# EasyEDA Pro project zkxh_robot_race_FOC_2025.eprj, schematic Schematic1
Board Name: stm32g431_foc; Create Date: 2025-09-25; Page Name: P1; Project Name: zkxh_robot_race_FOC_2025; Schematic Name: Schematic1; Update Date: 2025-09-27; Company: 嘉立创EDA; Page Size: A4; Version: V1.0
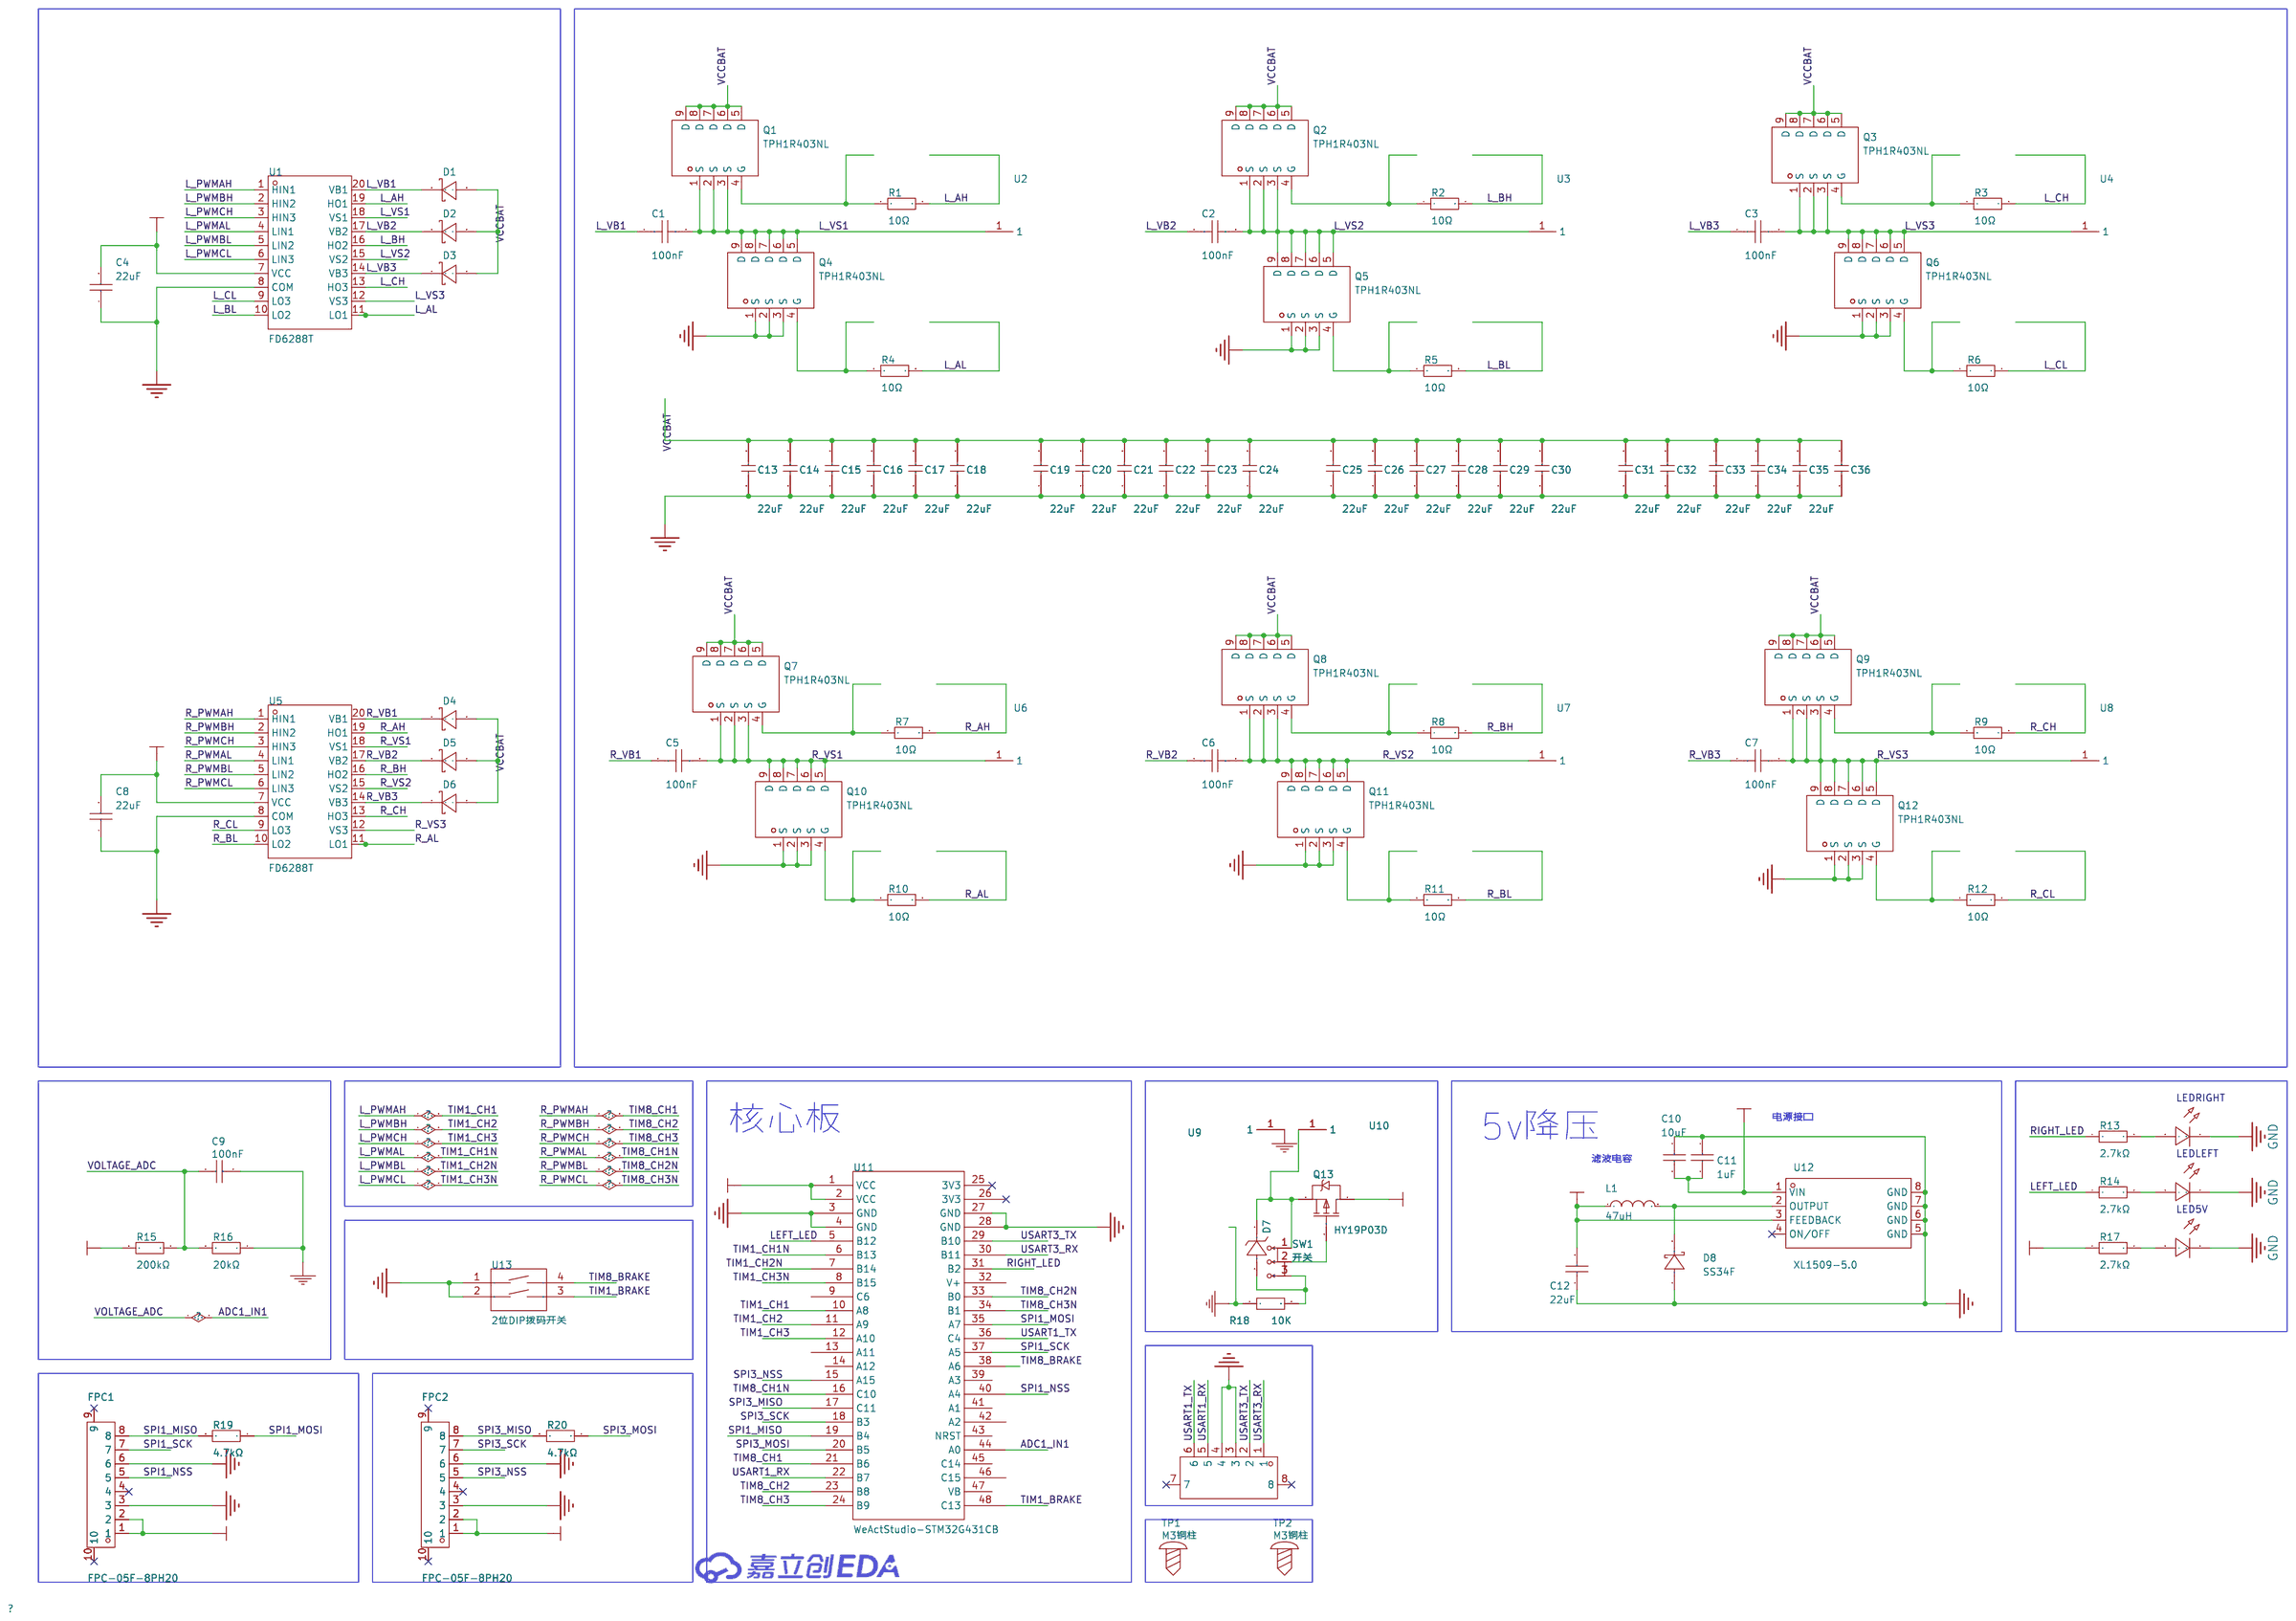
[diagram p0: schematic sheet]

## Parts
C1  100nF  [C0603]
C2  100nF  [C0603]
C3  100nF  [C0603]
C4  22uF  [C0603]
C5  100nF  [C0603]
C6  100nF  [C0603]
C7  100nF  [C0603]
C8  22uF  [C0603]
C9  100nF  [C0603]
C10  10uF  [C1206]
C11  1uF  [C0603]
C12  22uF  [C0603]
C13  22uF  [C1206]
C14  22uF  [C1206]
C15  22uF  [C1206]
C16  22uF  [C1206]
C17  22uF  [C1206]
C18  22uF  [C1206]
C19  22uF  [C1206]
C20  22uF  [C1206]
C21  22uF  [C1206]
C22  22uF  [C1206]
C23  22uF  [C1206]
C24  22uF  [C1206]
C25  22uF  [C1206]
C26  22uF  [C1206]
C27  22uF  [C1206]
C28  22uF  [C1206]
C29  22uF  [C1206]
C30  22uF  [C1206]
C31  22uF  [C1206]
C32  22uF  [C1206]
C33  22uF  [C1206]
C34  22uF  [C1206]
C35  22uF  [C1206]
C36  22uF  [C1206]
D1  1N5819WS  [SOD-323_L1.8-W1.3-LS2.5-RD]
D2  1N5819WS  [SOD-323_L1.8-W1.3-LS2.5-RD]
D3  1N5819WS  [SOD-323_L1.8-W1.3-LS2.5-RD]
D4  1N5819WS  [SOD-323_L1.8-W1.3-LS2.5-RD]
D5  1N5819WS  [SOD-323_L1.8-W1.3-LS2.5-RD]
D6  1N5819WS  [SOD-323_L1.8-W1.3-LS2.5-RD]
D7  BZT52C16  [SOD-123_L2.7-W1.7-LS3.8-RD]
D8  SS34F  [SMAF_L3.5-W2.6-LS4.7-FD]
FPC1  FPC-05F-8PH20  [FPC-SMD_8P-P0.50_FPC-05F-8PH20]
FPC2  FPC-05F-8PH20  [FPC-SMD_8P-P0.50_FPC-05F-8PH20]
L1  47uH  [IND-SMD_L7.0-W6.6_FXL0630]
LED5V  -  [LED_0805]
LEDLEFT  -  [LED_0805]
LEDRIGHT  -  [LED_0805]
Q1  TPH1R403NL  [DSOP-8_L5.0-W5.0-P1.27-LS6.0-BL-EP]
Q2  TPH1R403NL  [DSOP-8_L5.0-W5.0-P1.27-LS6.0-BL-EP]
Q3  TPH1R403NL  [DSOP-8_L5.0-W5.0-P1.27-LS6.0-BL-EP]
Q4  TPH1R403NL  [DSOP-8_L5.0-W5.0-P1.27-LS6.0-BL-EP]
Q5  TPH1R403NL  [DSOP-8_L5.0-W5.0-P1.27-LS6.0-BL-EP]
Q6  TPH1R403NL  [DSOP-8_L5.0-W5.0-P1.27-LS6.0-BL-EP]
Q7  TPH1R403NL  [DSOP-8_L5.0-W5.0-P1.27-LS6.0-BL-EP]
Q8  TPH1R403NL  [DSOP-8_L5.0-W5.0-P1.27-LS6.0-BL-EP]
Q9  TPH1R403NL  [DSOP-8_L5.0-W5.0-P1.27-LS6.0-BL-EP]
Q10  TPH1R403NL  [DSOP-8_L5.0-W5.0-P1.27-LS6.0-BL-EP]
Q11  TPH1R403NL  [DSOP-8_L5.0-W5.0-P1.27-LS6.0-BL-EP]
Q12  TPH1R403NL  [DSOP-8_L5.0-W5.0-P1.27-LS6.0-BL-EP]
Q13  HY19P03D  [TO-252-2_L6.6-W6.1-P4.57-LS9.9-TL-CW]
R1  10Ω  [R0603]
R2  10Ω  [R0603]
R3  10Ω  [R0603]
R4  10Ω  [R0603]
R5  10Ω  [R0603]
R6  10Ω  [R0603]
R7  10Ω  [R0603]
R8  10Ω  [R0603]
R9  10Ω  [R0603]
R10  10Ω  [R0603]
R11  10Ω  [R0603]
R12  10Ω  [R0603]
R13  2.7kΩ  [R0603]
R14  2.7kΩ  [R0603]
R15  200kΩ  [R0603]
R16  20kΩ  [R0603]
R17  2.7kΩ  [R0603]
R18  10K  [R0603]
R19  4.7kΩ  [R0603]
R20  4.7kΩ  [R0603]
SW1  开关  [SW-TH_SS-12D01-GX]
TP1  M3铜柱  [M3铜柱]
TP2  M3铜柱  [M3铜柱]
U1  FD6288T  [TSSOP-20_L6.5-W4.4-P0.65-LS6.4-BL]
U2  -  [单焊盘]
U3  -  [单焊盘]
U4  -  [单焊盘]
U5  FD6288T  [TSSOP-20_L6.5-W4.4-P0.65-LS6.4-BL]
U6  -  [单焊盘]
U7  -  [单焊盘]
U8  -  [单焊盘]
U9  -  [单焊盘]
U10  -  [单焊盘]
U11  WeActStudio-STM32G431CB  [WEACTSTUDIO-STM32G431CB]
U12  XL1509-5.0  [SOIC-8_L4.9-W3.9-P1.27-LS6.0-TR]
U13  2位DIP拨码开关  [SW-TH_4P-L9.9-W6.8-P7.62-BL]
U14  WAFER-GH1.25-6PWB  [CONN-SMD_6P-P1.25_XUNPU_WAFER-GH1.25-6PWB]

## Library data of the parts
C1-C3 C5-C7 = CC0603KRX7R9BB104: 容值:100nF;精度:±10%;额定电压:50V;材质(温度系数):X7R;; LCSC Part Name: 100nF ±10% 50V; Supplier Part: C14663; Manufacturer: YAGEO(国巨); Supplier Footprint: 0603; JLCPCB Part Class: 基础库; Datasheet: https://atta.szlcsc.com/upload/public/pdf/source/20180910/C282072_33301C7F631E79921B82A8DAC6BCC5B3.pdf; Supplier: LCSC; Tolerance: ±10%; Voltage Rated: 50V; Temperature Coefficient: X7R
C4 C8 = CC0603KRX7R9BB104: 容值:100nF;精度:±10%;额定电压:50V;材质(温度系数):X7R;; LCSC Part Name: 100nF ±10% 50V; Supplier Part: C14663; Manufacturer: YAGEO(国巨); Supplier Footprint: 0603; JLCPCB Part Class: Basic Part; Datasheet: https://atta.szlcsc.com/upload/public/pdf/source/20180910/C282072_33301C7F631E79921B82A8DAC6BCC5B3.pdf; Supplier: LCSC; Tolerance: ±10%; Voltage Rated: 50V; Temperature Coefficient: X7R
C9 = 100nF: Supplier: LCSC; Manufacturer: WTC; Manufacturer Part: 0603F104M500; Supplier Part: C94073; JLCPCB Part Class: Extended Part
C10 = CL31A106KBHNNNE: 容值:10uF;精度:±10%;额定电压:50V;材质(温度系数):X5R;; LCSC Part Name: 10uF ±10% 50V; Supplier Part: C13585; Manufacturer: SAMSUNG(三星); Supplier Footprint: 1206; Datasheet: https://atta.szlcsc.com/upload/public/pdf/source/20160103/1457707668742.pdf; Supplier: LCSC; Tolerance: ±10%; Voltage Rated: 50V; Temperature Coefficient: X5R
C11 = CL10A105KB8NNNC: 容值:1uF;精度:±10%;额定电压:50V;材质(温度系数):X5R;; LCSC Part Name: 1uF ±10% 50V; Supplier Part: C15849; Manufacturer: SAMSUNG(三星); Supplier Footprint: 0603; JLCPCB Part Class: Basic Part; Datasheet: https://atta.szlcsc.com/upload/public/pdf/source/20160218/1457707763339.pdf; Supplier: LCSC; Tolerance: ±10%; Voltage Rated: 50V; Temperature Coefficient: X5R
C12 = CL10A226MQ8NRNC: 容值:22uF;精度:±20%;额定电压:6.3V;材质(温度系数):X5R;; LCSC Part Name: 22uF ±20% 6.3V; Supplier Part: C59461; Manufacturer: SAMSUNG(三星); Supplier Footprint: 0603; JLCPCB Part Class: Basic Part; Datasheet: https://atta.szlcsc.com/upload/public/pdf/source/20160218/1457707763339.pdf; Supplier: LCSC; Tolerance: ±20%; Voltage Rated: 6.3V; Temperature Coefficient: X5R
C13-C36 = CGA1206X5R226M350NT: LCSC Part Name: 22uF ±20% 35V; Supplier Part: C6119969; Manufacturer: HRE(芯声); Supplier Footprint: 1206; JLCPCB Part Class: Extended Part; Datasheet: https://item.szlcsc.com/datasheet/CGA1206X5R226M350NT/7062675.html; Supplier: LCSC; Tolerance: ±20%; Voltage Rating: 35V; Temperature Coefficient: X5R
D1-D6 = 1N5819WS_C191023: 正向压降(Vf):600mV@1A;直流反向耐压(Vr):40V;平均整流电流(Io):1A;; LCSC Part Name: 电压:40V 电流:1A; Supplier Part: C191023; Manufacturer: Hottech(合科泰); Supplier Footprint: SOD-323; JLCPCB Part Class: 基础库; Datasheet: https://atta.szlcsc.com/upload/public/pdf/source/20220428/3CB86FD8D28D653594B4E35F9D5AEFD9.pdf; Supplier: LCSC; Forward Voltage (Vf@If): 600mV@1A; Reverse Voltage (Vr): 40V; Average Rectified Current (Io): 1A
D7 = BZT52C16_C727007: 二极管配置:独立式;稳压值(标称值):16V;稳压值(范围):15.3V~17.1V;功率:500mW;精度:-;; Supplier Part: C727007; Manufacturer: TWGMC(台湾迪嘉); Supplier Footprint: SOD-123; JLCPCB Part Class: Extended Part; Datasheet: https://atta.szlcsc.com/upload/public/pdf/source/20200828/C727006_A23CB424A23C0F54CFF10A724B844049.pdf; Supplier: LCSC; Diode Configuration: 独立式; Zener Voltage (Nom): 16V; Reverse Leakage Current (Ir): 100nA@11.2V; Zener Voltage (Range): 15.3V~17.1V; Power Dissipation: 500mW; Zener Impedance (Zzt): 40Ω
D8 = SS34F_C908239: 二极管配置:独立式;正向压降(Vf):550mV@3A;直流反向耐压(Vr):40V;平均整流电流(Io):3A;; LCSC Part Name: 电压:40V 电流:3A; Supplier Part: C908239; Manufacturer: FUXINSEMI(富芯森美); Supplier Footprint: SMAF(DO-214AD); Datasheet: https://atta.szlcsc.com/upload/public/pdf/source/20201027/C908239_FC8ECC0377ED2542EFBAA82131BEFB7E.pdf; Supplier: LCSC; Diode Configuration: 独立式; Forward Voltage (Vf@If): 550mV@3A; Reverse Voltage (Vr): 40V; Average Rectified Current (Io): 3A; Reverse Leakage Current (Ir): 500nA
FPC1 FPC2 = FPC-05F-8PH20: 锁定特性:翻盖式;触点类型:下接;触点数量:8P;间距:0.5mm;安装类型:卧贴;工作温度范围:-25℃~+85℃;; LCSC Part Name: 间距:0.5mm P数:8P 翻盖式 下接; Supplier Part: C2856797; Manufacturer: XUNPU(讯普); Supplier Footprint: SMD,P=0.5mm,卧贴; Datasheet: https://atta.szlcsc.com/upload/public/pdf/source/20210728/C2856796_EA80EFD10E16055FE067E7763B90421F.pdf; Supplier: LCSC; Locking Feature: 翻盖式; Contact Type: 下接; Number of Contacts: 8P; Pitch: 0.5mm; Mounting Type: 卧贴; FFC, FCB Thickness: 0.3mm; Height Above Board: 2mm; Operating Temperature Range: -25℃~+85℃
L1 = FXL0630-470-M: 电感值:47uH;精度:±20%;额定电流:1.5A;饱和电流(Isat):2A;类型:一体成型电感;; LCSC Part Name: 47uH ±20% 2A; Supplier Part: C475913; Manufacturer: cjiang(长江微电); Supplier Footprint: SMD,6.6x7mm; JLCPCB Part Class: Extended Part; Datasheet: https://atta.szlcsc.com/upload/public/pdf/source/20240426/3189EA8206330E2108542F9E34E540E7.pdf; Supplier: LCSC; Tolerance: ±20%; Rated Current: 1.5A; Saturation Current (Isat): 2A; DC Resistance (DCR): 385mΩ; Type: 一体成型电感
LED5V LEDLEFT LEDRIGHT = LED_0805-B: Supplier Footprint: 0805
Q1-Q12 = TPH1R403NL_C83440: 类型:N沟道;漏源电压(Vdss):30V;连续漏极电流(Id):150A;功率(Pd):64W;导通电阻(RDS(on)@Vgs,Id):1.4mΩ@10V,30A;阈值电压(Vgs(th)@Id):2.3V@500uA;; LCSC Part Name: N沟道 耐压:30V 电流:150A; Supplier Part: C83440; Manufacturer: TOSHIBA(东芝); Supplier Footprint: DFN-8(5x6); JLCPCB Part Class: 扩展库; Datasheet: https://atta.szlcsc.com/upload/public/pdf/source/20170908/C83440_1504870121708958077.pdf; Supplier: LCSC; Type: N沟道; Drain Source Voltage (Vdss): 30V; Continuous Drain Current (Id): 150A; Power Dissipation (Pd): 64W; Drain Source On Resistance (RDS(on)@Vgs,Id): 1.4mΩ@10V,30A; Gate Threshold Voltage (Vgs(th)@Id): 2.3V@500uA
Q13 = HY19P03D: 类型:P沟道;漏源电压(Vdss):30V;连续漏极电流(Id):90A;功率(Pd):50W;导通电阻(RDS(on)@Vgs,Id):6mΩ@10V,45A;阈值电压(Vgs(th)@Id):3V@250uA;; LCSC Part Name: P沟道 耐压:30V 电流:90A; Supplier Part: C122492; Manufacturer: HUAYI(华羿微); Supplier Footprint: TO-252-2; JLCPCB Part Class: 扩展库; Datasheet: https://atta.szlcsc.com/upload/public/pdf/source/20170728/C122492_1501225751911848809.pdf; Supplier: LCSC; Type: P沟道; Drain Source Voltage (Vdss): 30V; Continuous Drain Current (Id): 90A; Power Dissipation (Pd): 50W; Drain Source On Resistance (RDS(on)@Vgs,Id): 6mΩ@10V,45A; Gate Threshold Voltage (Vgs(th)@Id): 3V@250uA
R1-R12 = 0603WAF100JT5E: 电阻类型:厚膜电阻;阻值:10Ω;精度:±1%;功率:100mW;最大工作电压:75V;温度系数:±400ppm/℃;; LCSC Part Name: 10Ω ±1% 100mW 厚膜电阻; Supplier Part: C22859; Manufacturer: UNI-ROYAL(厚声); Supplier Footprint: 0603; JLCPCB Part Class: 基础库; Datasheet: https://atta.szlcsc.com/upload/public/pdf/source/20200306/C422600_1E6D84923E4A46A82E41ADD87F860B5C.pdf; Supplier: LCSC; Type: 厚膜电阻; Tolerance: ±1%; Power(Watts): 100mW; Overload Voltage (Max): 75V; Temperature Coefficient: ±400ppm/℃; Operating Temperature Range: -55℃~+155℃
R13 R14 R17 = RM06JTN272: 阻值:2.7kΩ;精度:±5%;功率:100mW;; LCSC Part Name: 2.7kΩ ±5% 100mW; Supplier Part: C188127; Manufacturer: 大毅科技; Supplier Footprint: 0603; JLCPCB Part Class: 扩展库; Datasheet: https://atta.szlcsc.com/upload/public/pdf/source/20180321/FCA3E4F1B69F2780670124EB5664EA2E.pdf; Supplier: LCSC; Tolerance: ±5%; Power(Watts): 100mW; Temperature Coefficient: ±200ppm/℃
R15 = 0603WAF2003T5E: LCSC Part Name: 200kΩ ±1% 100mW 厚膜电阻; Supplier Part: C25811; Manufacturer: UNI-ROYAL(厚声); Supplier Footprint: 0603; JLCPCB Part Class: Basic Part; Datasheet: https://atta.szlcsc.com/upload/public/pdf/source/20200306/C422600_1E6D84923E4A46A82E41ADD87F860B5C.pdf; Supplier: LCSC; Type: 厚膜电阻; Tolerance: ±1%; Power(Watts): 100mW; Overload Voltage (Max): 75V; Temperature Coefficient: ±100ppm/℃; Operating Temperature Range: -55℃~+155℃
R16 = 0603WAF2002T5E: LCSC Part Name: 20kΩ ±1% 100mW 厚膜电阻; Supplier Part: C4184; Manufacturer: UNI-ROYAL(厚声); Supplier Footprint: 0603; JLCPCB Part Class: Basic Part; Datasheet: https://item.szlcsc.com/datasheet/0603WAF2002T5E/4591.html; Supplier: LCSC; Type: 厚膜电阻; Tolerance: ±1%; Power(Watts): 100mW; Voltage-Supply(Max): 75V; Temperature Coefficient: ±100ppm/℃; Operating Temperature: -55℃~+155℃
R18 = 10K: 3DModel: R0603_L1.6-W0.8-H0.8; link: https://www.mouser.in/datasheet/2/447/PYu_RT_1_to_0_01_RoHS_L_11-1669912.pdf; Supplier: LCSC; Supplier Part: C217687; Manufacturer: Viking Tech; Manufacturer Part: ARG03FTC1002; JLCPCB Part Class: Extended Part
R19 R20 = 0603WAF4701T5E: LCSC Part Name: 4.7kΩ ±1% 100mW 厚膜电阻; Supplier Part: C23162; Manufacturer: UNI-ROYAL(厚声); Supplier Footprint: 0603; JLCPCB Part Class: Basic Part; Datasheet: https://item.szlcsc.com/datasheet/0603WAF4701T5E/23889.html; Supplier: LCSC; Type: 厚膜电阻; Tolerance: ±1%; Power(Watts): 100mW; Voltage-Supply(Max): 75V; Temperature Coefficient: ±100ppm/℃; Operating Temperature: -55℃~+155℃
SW1 = 开关: Supplier Part: C9900023015; Supplier Footprint: SW-TH; JLCPCB Part Class: 扩展库; Supplier: LCSC
TP1 TP2 = M3铜柱
U1 U5 = FD6288T_C5804616: 驱动配置:高低侧;负载类型:MOSFET;峰值灌电流:1.5A;峰值拉电流:1.8A;电源电压:8V~20V;; Supplier Part: C5804616; Manufacturer: JSMSEMI(杰盛微); Supplier Footprint: TSSOP-20; JLCPCB Part Class: Extended Part; Datasheet: https://atta.szlcsc.com/upload/public/pdf/source/20230505/E489ED7BEA890DFBBDAD461AC13FC372.pdf; Supplier: LCSC; Driven Configuration: 高低侧; Load Type: MOSFET; Peak Output Current(sink): 1.5A; Peak Output Current(source): 1.8A; Supply Voltage: 8V~20V
U2-U4 U6-U10 = 单焊盘
U11 = WeActStudio-STM32G431CB
U12 = XL1509-5.0: Supplier Part: C2902368; Manufacturer: UMW(广东友台半导体); Supplier Footprint: SOIC-8; Datasheet: https://atta.szlcsc.com/upload/public/pdf/source/20230412/A4F395BE4384B04485E6C784EB623363.pdf; Supplier: LCSC
U13 = 2位DIP拨码开关: Supplier Part: C9900014698; Supplier Footprint: CSWDIP-2P; JLCPCB Part Class: 扩展库; Supplier: LCSC
U14 = WAFER-GH1.25-6PWB: 插针结构:1x6P;间距:1.25mm;安装方式:卧贴;参考系列:GH;总PIN数:6P;排数:1;每排PIN数:6;行距:-;额定电流:1A;触头材质:黄铜;触头镀层:-;工作温度范围:-25℃~+85℃;; LCSC Part Name: 1x6P 间距:1.25mm 卧贴 系列:GH; Supplier Part: C3029381; Manufacturer: XUNPU(讯普); Supplier Footprint: SMD,P=1.25mm,卧贴; JLCPCB Part Class: 扩展库; Datasheet: https://atta.szlcsc.com/upload/public/pdf/source/20220527/CB8773BFB0913C3B8ABD62CB38BA101A.pdf; Supplier: LCSC; Pins Structure: 1x6P; Pitch: 1.25mm; Mounting Type: 卧贴; Reference Series: GH; Number of Pins: 6P; Number of Rows: 1; Number of PINs Per Row: 6; Current Rating: 1A; Contact Material: 黄铜; Operating Temperature: -25℃~+85℃; Voltage Rating: 125V; Plastic Material: LCP; Supplementary Features: 辅助焊脚; Color: 米色; Z-Height of the Board: 4.35mm; X-Length of Bottom Edge on Board (Spacing Line): 10.75mm; Y-Width of Bottom Edge on Board: 5mm

## Nets
GND: C4.1 C8.1 C9.2 C10.2 C11.2 C12.1 C13.1 C14.1 C15.1 C16.1 C17.1 C18.1 C19.1 C20.1 C21.1 C22.1 C23.1 C24.1 C25.1 C26.1 C27.1 C28.1 C29.1 C30.1 C31.1 C32.1 C33.1 C34.1 C35.1 C36.1 D8.1(A) FPC1.3 FPC1.6 FPC2.3 FPC2.6 LED5V.1(C) LEDLEFT.1(C) LEDRIGHT.1(C) Q4.1(S) Q4.2(S) Q4.3(S) Q5.1(S) Q5.2(S) Q5.3(S) Q6.1(S) Q6.2(S) Q6.3(S) Q10.1(S) Q10.2(S) Q10.3(S) Q11.1(S) Q11.2(S) Q11.3(S) Q12.1(S) Q12.2(S) Q12.3(S) R16.1 R18.1 U1.8(COM) U5.8(COM) U9.1 U11.3(GND) U11.4(GND) U11.27(GND) U11.28(GND) U12.5(GND) U12.6(GND) U12.7(GND) U12.8(GND) U13.1 U13.2 U14.3 U14.4
VCC5V: C12.2 FPC1.1 FPC1.2 FPC2.1 FPC2.2 L1.1 R17.1 U11.1(VCC) U11.2(VCC) U12.3(FEEDBACK)
VCCBAT: C4.2 C8.2 C10.1 C11.1 C13.2 C14.2 C15.2 C16.2 C17.2 C18.2 C19.2 C20.2 C21.2 C22.2 C23.2 C24.2 C25.2 C26.2 C27.2 C28.2 C29.2 C30.2 C31.2 C32.2 C33.2 C34.2 C35.2 C36.2 D1.2(A) D2.2(A) D3.2(A) D4.2(A) D5.2(A) D6.2(A) Q1.5(D) Q1.6(D) Q1.7(D) Q1.8(D) Q1.9(D) Q2.5(D) Q2.6(D) Q2.7(D) Q2.8(D) Q2.9(D) Q3.5(D) Q3.6(D) Q3.7(D) Q3.8(D) Q3.9(D) Q7.5(D) Q7.6(D) Q7.7(D) Q7.8(D) Q7.9(D) Q8.5(D) Q8.6(D) Q8.7(D) Q8.8(D) Q8.9(D) Q9.5(D) Q9.6(D) Q9.7(D) Q9.8(D) Q9.9(D) Q13.2(D) R15.2 U1.7(VCC) U5.7(VCC) U12.1(VIN)
ADC1_IN1: C9.1 R15.1 R16.2 U11.44(A0)
L_AH: R1.2 U1.19(HO1)
L_AL: R4.2 U1.11(LO1)
L_BH: R2.2 U1.16(HO2)
L_BL: R5.2 U1.10(LO2)
L_CH: R3.2 U1.13(HO3)
L_CL: R6.2 U1.9(LO3)
L_PWMAH: U1.1(HIN1) U11.10(A8)
L_PWMAL: U1.4(LIN1) U11.6(B13)
L_PWMBH: U1.2(HIN2) U11.11(A9)
L_PWMBL: U1.5(LIN2) U11.7(B14)
L_PWMCH: U1.3(HIN3) U11.12(A10)
L_PWMCL: U1.6(LIN3) U11.8(B15)
L_VB1: C1.1 D1.1(K) U1.20(VB1)
L_VB2: C2.1 D2.1(K) U1.17(VB2)
L_VB3: C3.1 D3.1(K) U1.14(VB3)
L_VS1: C1.2 Q1.1(S) Q1.2(S) Q1.3(S) Q4.5(D) Q4.6(D) Q4.7(D) Q4.8(D) Q4.9(D) U1.18(VS1) U2.1
L_VS2: C2.2 Q2.1(S) Q2.2(S) Q2.3(S) Q5.5(D) Q5.6(D) Q5.7(D) Q5.8(D) Q5.9(D) U1.15(VS2) U3.1
L_VS3: C3.2 Q3.1(S) Q3.2(S) Q3.3(S) Q6.5(D) Q6.6(D) Q6.7(D) Q6.8(D) Q6.9(D) U1.12(VS3) U4.1
LEFT_LED: R14.1 U11.5(B12)
R_AH: R7.2 U5.19(HO1)
R_AL: R10.2 U5.11(LO1)
R_BH: R8.2 U5.16(HO2)
R_BL: R11.2 U5.10(LO2)
R_CH: R9.2 U5.13(HO3)
R_CL: R12.2 U5.9(LO3)
R_PWMAH: U5.1(HIN1) U11.21(B6)
R_PWMAL: U5.4(LIN1) U11.16(C10)
R_PWMBH: U5.2(HIN2) U11.23(B8)
R_PWMBL: U5.5(LIN2) U11.33(B0)
R_PWMCH: U5.3(HIN3) U11.24(B9)
R_PWMCL: U5.6(LIN3) U11.34(B1)
R_VB1: C5.1 D4.1(K) U5.20(VB1)
R_VB2: C6.1 D5.1(K) U5.17(VB2)
R_VB3: C7.1 D6.1(K) U5.14(VB3)
R_VS1: C5.2 Q7.1(S) Q7.2(S) Q7.3(S) Q10.5(D) Q10.6(D) Q10.7(D) Q10.8(D) Q10.9(D) U5.18(VS1) U6.1
R_VS2: C6.2 Q8.1(S) Q8.2(S) Q8.3(S) Q11.5(D) Q11.6(D) Q11.7(D) Q11.8(D) Q11.9(D) U5.15(VS2) U7.1
R_VS3: C7.2 Q9.1(S) Q9.2(S) Q9.3(S) Q12.5(D) Q12.6(D) Q12.7(D) Q12.8(D) Q12.9(D) U5.12(VS3) U8.1
RIGHT_LED: R13.1 U11.31(B2)
SPI1_MISO: FPC1.8 R19.2 U11.19(B4)
SPI1_MOSI: R19.1 U11.35(A7)
SPI1_NSS: FPC1.5 U11.40(A4)
SPI1_SCK: FPC1.7 U11.37(A5)
SPI3_MISO: FPC2.8 R20.2 U11.17(C11)
SPI3_MOSI: R20.1 U11.20(B5)
SPI3_NSS: FPC2.5 U11.15(A15)
SPI3_SCK: FPC2.7 U11.18(B3)
TIM1_BRAKE: U11.48(C13) U13.3
TIM8_BRAKE: U11.38(A6) U13.4
USART1_RX: U11.22(B7) U14.5
USART1_TX: U11.36(C4) U14.6
USART3_RX: U11.30(B11) U14.1
USART3_TX: U11.29(B10) U14.2
$1N4251: Q1.4(G) R1.1
$1N4259: Q5.4(G) R5.1
$1N4264: Q6.4(G) R6.1
$1N4273: Q2.4(G) R2.1
$1N4274: Q3.4(G) R3.1
$1N4289: Q4.4(G) R4.1
$1N4330: Q8.4(G) R8.1
$1N4338: Q12.4(G) R12.1
$1N4343: Q10.4(G) R10.1
$1N4352: Q9.4(G) R9.1
$1N4353: Q7.4(G) R7.1
$1N4368: Q11.4(G) R11.1
$1N6318: LED5V.2(A) R17.2
$1N6323: D8.2(K) L1.2 U12.2(OUTPUT)
$1N6425: LEDLEFT.2(A) R14.2
$1N6508: LEDRIGHT.2(A) R13.2
$1N6790: D7.2(A) R18.2 SW1.3
$1N6792: Q13.1(G) SW1.2
$1N6897: D7.1(K) Q13.3(S) SW1.1 U10.1

Not connected (* = marked no-connect by the designer): FPC1 4* 9* 10*; FPC2 4* 9* 10*; U11 9(C6) 13(A11) 14(A12) 25(3V3)* 26(3V3)* 32(V+) 39(A3) 41(A1) 42(A2) 43(NRST) 45(C14) 46(C15) 47(VB); U12 4(ON/OFF)*; U14 7* 8*

## Notes on the sheet
- 电源接口
- 核心板
- 5v降压
- 滤波电容
